# EAGLE schematic powerctl (EAGLE 7.7.0)
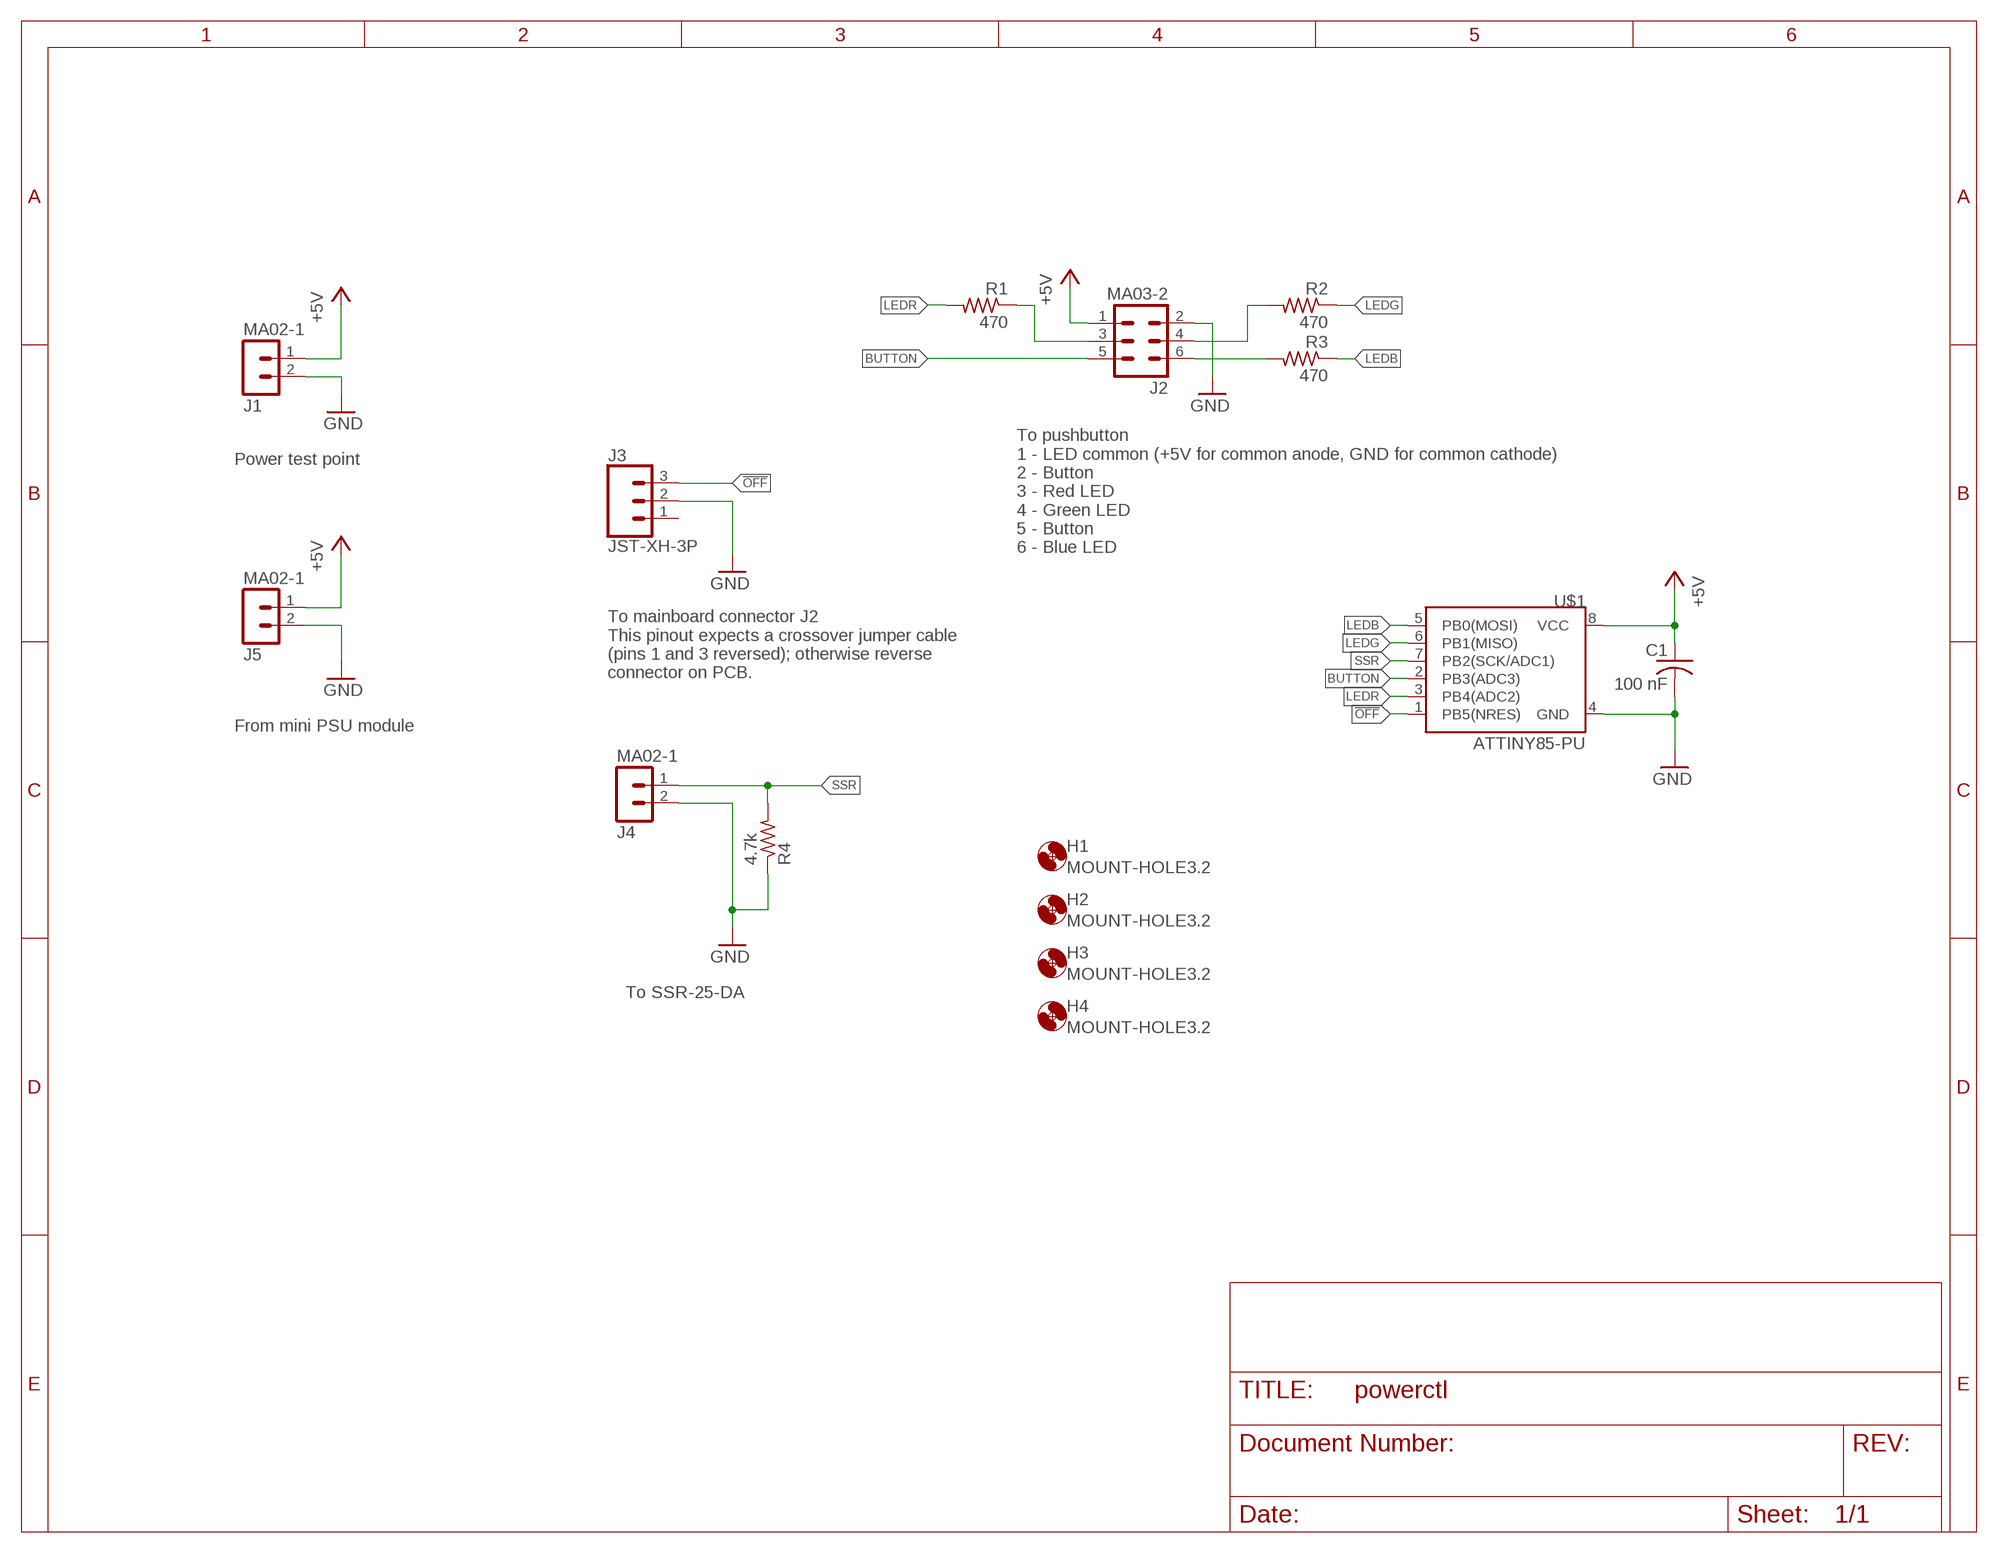
[diagram p0: schematic, sheet 1]

## Parts
C1  100 nF  C-US025-025X050  [C025-025X050]
H1  MOUNT-HOLE3.2  [3,2]
H2  MOUNT-HOLE3.2  [3,2]
H3  MOUNT-HOLE3.2  [3,2]
H4  MOUNT-HOLE3.2  [3,2]
J1  MA02-1  [MA02-1]
J2  MA03-2  [MA03-2]
J3  JST-XH-3P  CONN_03JST-PTH-VERT  [JST-3-PTH-VERT]
J4  MA02-1  [MA02-1]
J5  MA02-1  [MA02-1]
R1  470  R-US_0204/7  [0204/7]
R2  470  R-US_0204/7  [0204/7]
R3  470  R-US_0204/7  [0204/7]
R4  4.7k  R-US_0204/7  [0204/7]
U$1  ATTINY85-PU  ATTINY13DIP  [DIP08]

## Nets
!OFF: J3.3 U$1.1(PB5(NRES))
+5V [supply]: C1.1 J1.1 J2.1 J5.1 U$1.8(VCC)
BUTTON: J2.5 U$1.2(PB3(ADC3))
GND [supply]: C1.2 J1.2 J2.2 J3.2 J4.2 J5.2 R4.1 U$1.4(GND)
LEDB: R3.1 U$1.5(PB0(MOSI))
LEDG: R2.1 U$1.6(PB1(MISO))
LEDR: R1.2 U$1.3(PB4(ADC2))
N$1: J2.6 R3.2
N$2: J2.3 R1.1
N$3: J2.4 R2.2
SSR: J4.1 R4.2 U$1.7(PB2(SCK/ADC1))
Unconnected: J3.1

## Notes on the sheet
- Power test point
- To pushbutton
  1 - LED common (+5V for common anode, GND for common cathode)
  2 - Button
  3 - Red LED
  4 - Green LED
  5 - Button
  6 - Blue LED
- To mainboard connector J2
  This pinout expects a crossover jumper cable
  (pins 1 and 3 reversed); otherwise reverse
  connector on PCB.
- From mini PSU module
- To SSR-25-DA

## Library data of the parts
C1 = rcl:C-US: CAPACITOR, American symbol
H1-H4 = holes:MOUNT-HOLE: MOUNTING HOLE with drill center marker
J1 J4 J5 = con-lstb:MA02-1
J2 = con-lstb:MA03-2: PIN HEADER; OC_FARNELL: unknown; OC_NEWARK: unknown
J3 = SparkFun-Connectors:CONN_03: Multi connection point. Often used as Generic Header-pin footprint for 0.1 inch spaced/style header connections On any of the 0.1 inch spaced packages, you can populate with these: Break Away Headers - Straight <https://www.sparkfun.com/products/116> (PRT-00116) Break Away Male Headers - Right Angle <https://www.sparkfun.com/products/553> (PRT-00553) Female Headers <https://www.sparkfun.com/products/115> (PRT-00115) Break Away Headers - Machine Pin <https://www.sparkfun.com/products/117> (PRT-00117) Break Away Female Headers - Swiss Machine Pin <https://www.sparkfun.com/products/743> (PRT-00743) Stackable Header - 3 Pin (Female, 0.1") <https://www.sparkfun.com/products/13875> (PRT-13875) For SCREWTERMINALS and SPRING TERMINALS visit here: Screw Terimnals on SparkFun.com <https://www.sparkfun.com/search/results?term=Screw+Terminals> (5mm/3.5mm/2.54mm spacing) This device is also useful as a general connection point to wire up your design to another part of your project. Our various solder wires solder well into these plated through hole pads. Hook-Up Wire - Assortment (Stranded, 22 AWG) <https://www.sparkfun.com/products/11375> (PRT-11375) Hook-Up Wire - Assortment (Solid Core, 22 AWG) <https://www.sparkfun.com/products/11367> (PRT-11367) View the entire wire category on our website here <https://www.sparkfun.com/categories/141> Special notes: Molex polarized connector foot print use with SKU : PRT-08232 with associated crimp pins and housings.; PROD_ID: CONN-13230
R1-R4 = rcl:R-US_: RESISTOR, American symbol
U$1 = SparkFun:ATTINY13

## Net classes
0 default: width 0.381 mm
1 supply: width 0.762 mm